# Altium schematic sheet Wyswietlacz.SchDoc
size 292 x 193 mm; Opracowal: Mieszko Mazurkiewicz; projRevision: MS; Author: Mieszko Mazurkiewicz; CompanyName: Politechnika Warszawska; Organization: EITI; Address1: Nowowiejska 15/19; Address2: 00-665 Warszawa; Revision: MS; SheetNumber: 8; SheetTotal: 8; HTTPLink: www.pw.edu.pl
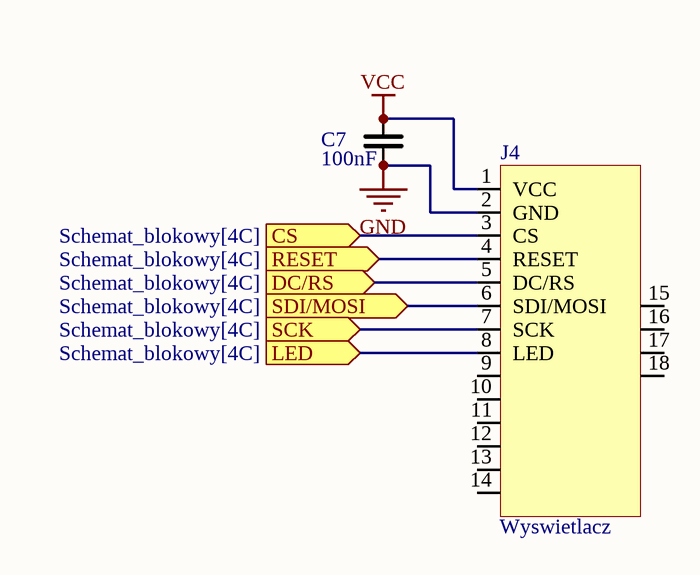
[diagram p0: Wyswietlacz.SchDoc]

## Parts
C7  100nF  [0603_CAP]
J4  Wyswietlacz  [pin_header_LCD]

## Ports
CS (in, see Schemat_blokowy[4C]), DC/RS (in, see Schemat_blokowy[4C]), LED (in, see Schemat_blokowy[4C]), RESET (in, see Schemat_blokowy[4C]), SCK (in, see Schemat_blokowy[4C]), SDI/MOSI (in, see Schemat_blokowy[4C])

## Nets
GND: C7.1 J4.2(GND)
VCC: C7.2 J4.1(VCC)
CS: J4.3(CS) ; port CS
DC/RS: J4.5(DC/RS) ; port DC/RS
LED: J4.8(LED) ; port LED
RESET: J4.4(RESET) ; port RESET
SCK: J4.7(SCK) ; port SCK
SDI/MOSI: J4.6(SDI/MOSI) ; port SDI/MOSI

Not connected (* = marked no-connect by the designer): J4 9 10 11 12 13 14 15 16 17 18

## Notes on the sheet
- Data:
- Tytuł:
- Rev.:
- Rozm.:
- A4
- Strona:
- z
- PBL4
- Opracował:

## Library data of the parts
C7 = Cap: Ceramic capacitor; Value: 100nF
J4 = Pin Header Wyswietlacz: Dispaly; PartNumber: ILI9486